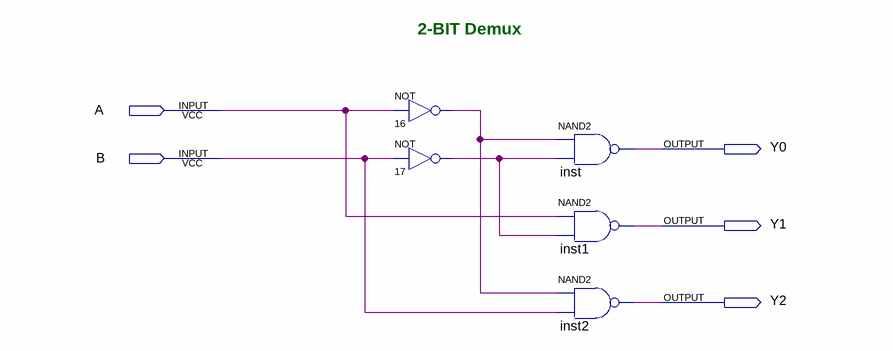
[diagram p0: schematic sheet]
// Quartus schematic 2demux3.bdf as structural Verilog: 5 symbols, 5 pins
module \2demux3  (
  input  A,
  input  B,
  output Y0,
  output Y1,
  output Y2
);

  wire n16_out, n17_out;

  not u_16 (n16_out, A);
  not u_17 (n17_out, B);
  nand inst (Y0, n16_out, n17_out);
  nand inst1 (Y1, A, n17_out);
  nand inst2 (Y2, n16_out, B);

  // Notes on the sheet:
  //   2-BIT Demux
endmodule
